# Altium schematic sheet SENSOR.SchDoc
size A3; Organization: Altium Limited; Address1: L3, 12a Rodborough Rd; Address2: Frenchs Forest; Address3: NSW; Address4: Australia 2086; DocumentNumber: 4; SheetNumber: 4; SheetTotal: 5
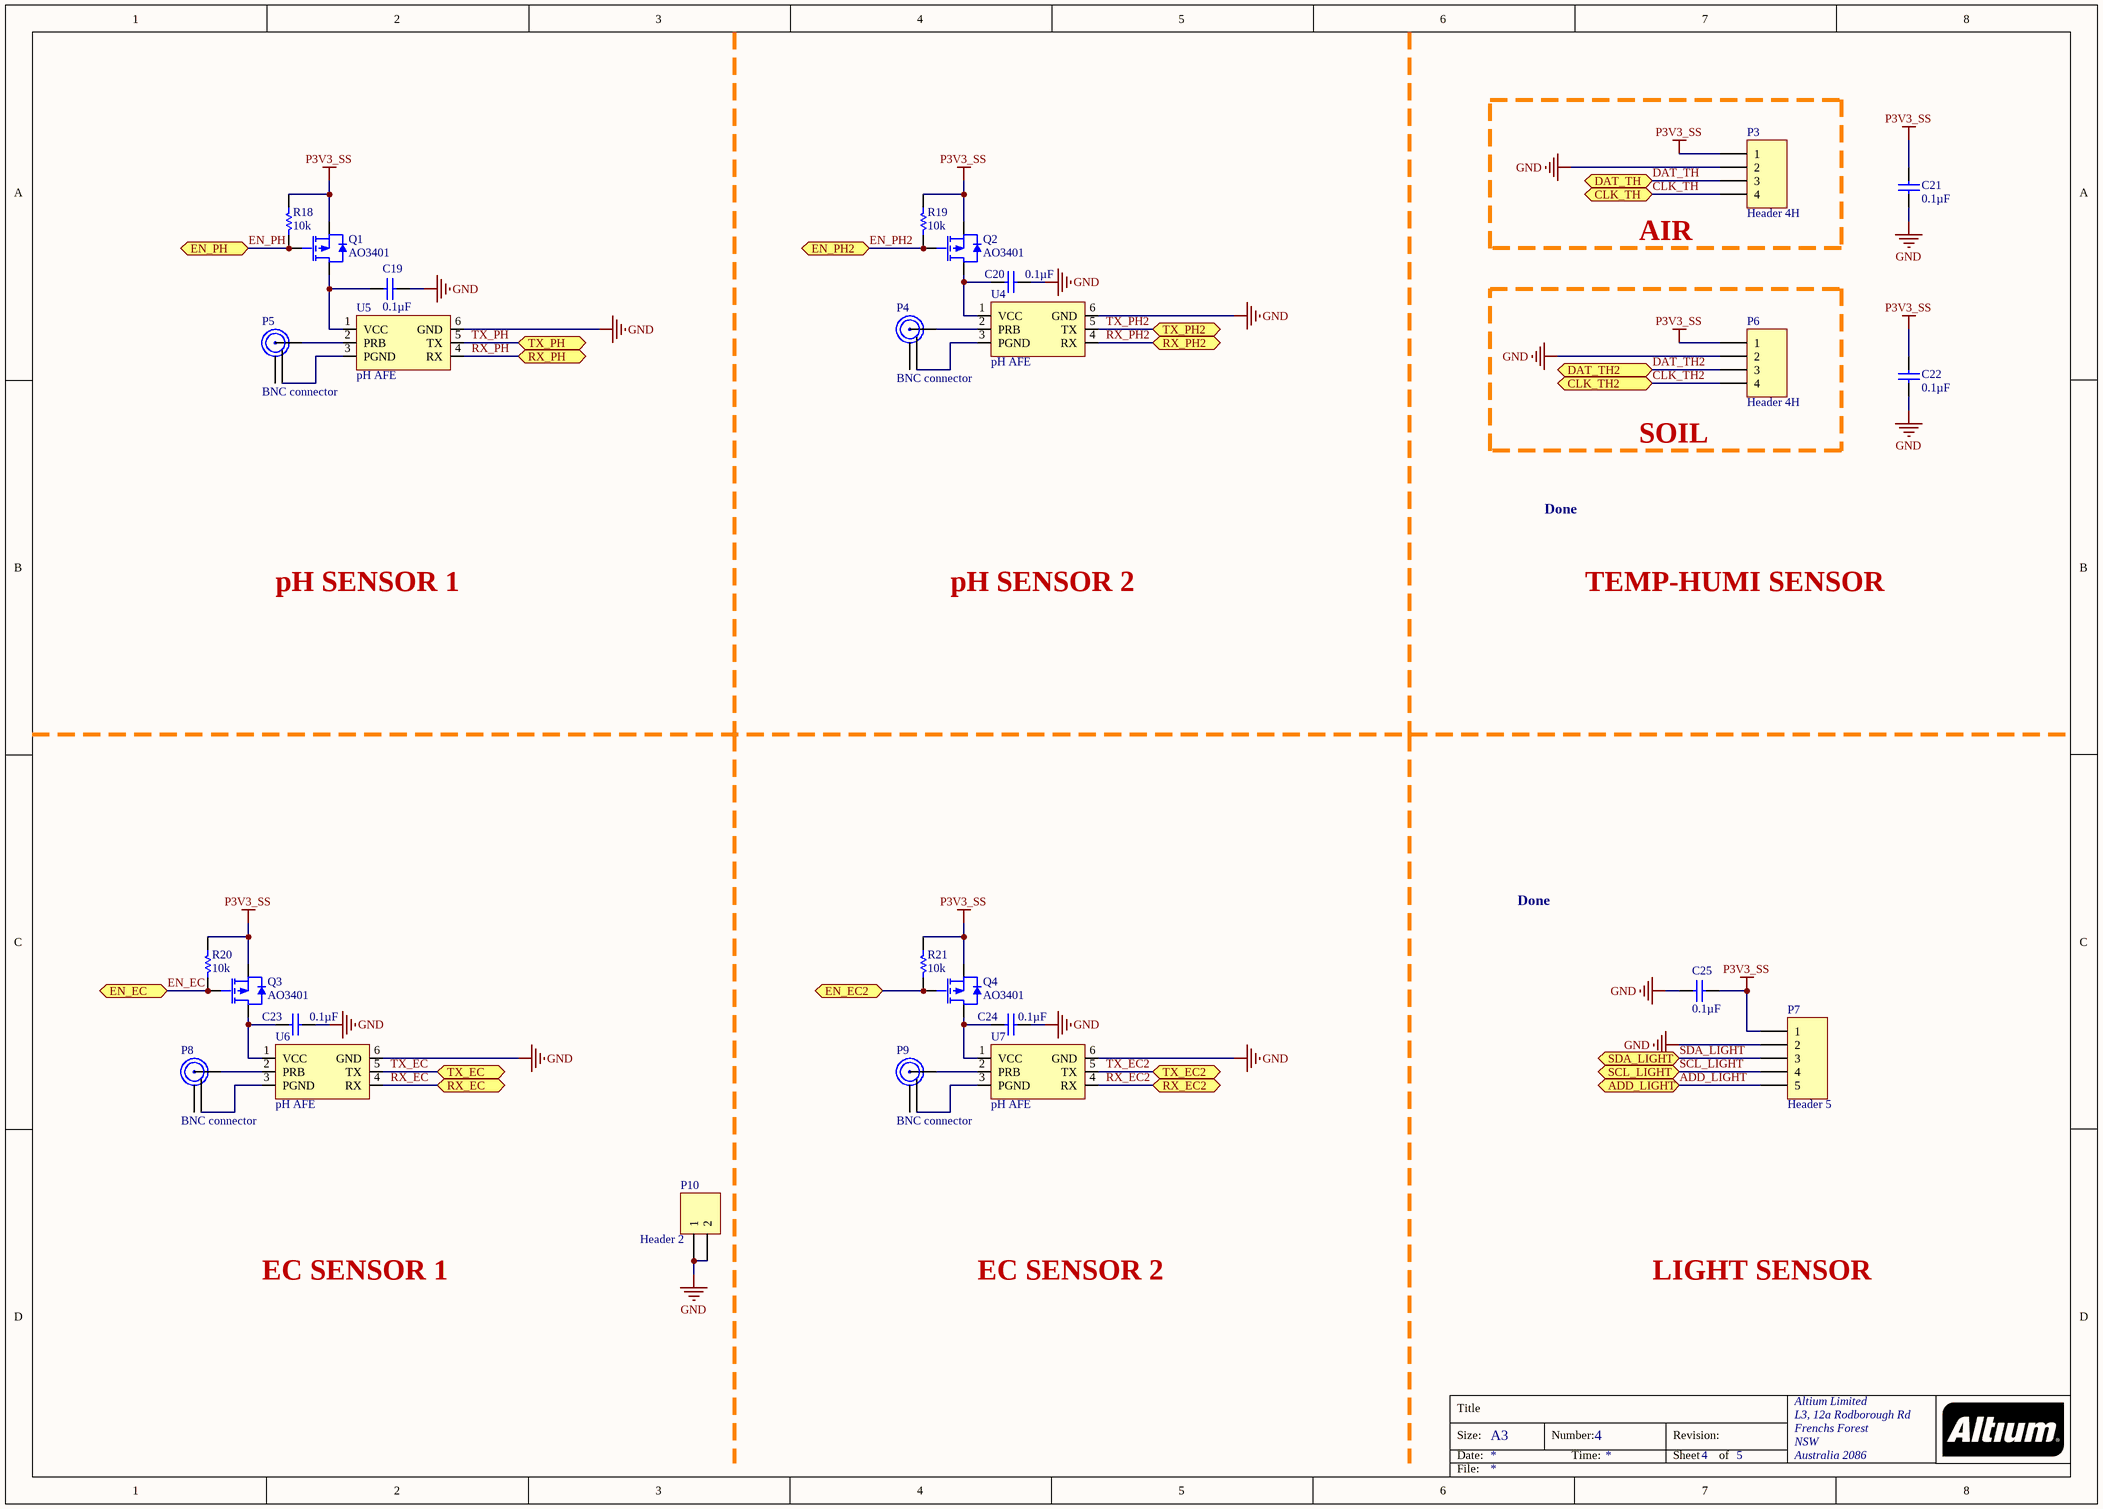
[diagram p0: SENSOR.SchDoc]

## Parts
C19  0.1µF  [C0402M]
C20  0.1µF  [C0402M]
C21  0.1µF  [C0402M]
C22  0.1µF  [C0402M]
C23  0.1µF  [C0402M]
C24  0.1µF  [C0402M]
C25  0.1µF  [C0402M]
P3  Header 4H  [TERMINAL4_5.08]
P4  BNC connector  [BNC]
P5  BNC connector  [BNC]
P6  Header 4H  [TERMINAL4_5.08]
P7  Header 5  [TERMINAL5_5.08]
P8  BNC connector  [BNC]
P9  BNC connector  [BNC]
P10  Header 2  [HED2T]
Q1  AO3401  [SOT23-3N]
Q2  AO3401  [SOT23-3N]
Q3  AO3401  [SOT23-3N]
Q4  AO3401  [SOT23-3N]
R18  10k  [R0603M]
R19  10k  [R0603M]
R20  10k  [R0603M]
R21  10k  [R0603M]
U4  pH AFE  [pH AFE]
U5  pH AFE  [pH AFE]
U6  pH AFE  [pH AFE]
U7  pH AFE  [pH AFE]

## Blocks framed on the sheet
AIR: P3
SOIL: P6

## Ports
ADD_LIGHT, CLK_TH, CLK_TH2, DAT_TH, DAT_TH2, EN_EC, EN_EC2, EN_PH, EN_PH2, RX_EC, RX_EC2, RX_PH, RX_PH2, SCL_LIGHT, SDA_LIGHT, TX_EC, TX_EC2, TX_PH, TX_PH2

## Nets
GND: C19.1 C20.1 C21.1 C22.1 C23.1 C24.1 C25.1 P3.2 P6.2 P7.2 P10.1 P10.2 U4.6(GND) U5.6(GND) U6.6(GND) U7.6(GND)
P3V3_SS: C21.2 C22.2 C25.2 P3.1 P6.1 P7.1 Q1.2(S) Q2.2(S) Q3.2(S) Q4.2(S) R18.2 R19.2 R20.2 R21.2
ADD_LIGHT: P7.5 ; port ADD_LIGHT
CLK_TH: P3.4 ; port CLK_TH
CLK_TH2: P6.4 ; port CLK_TH2
DAT_TH: P3.3 ; port DAT_TH
DAT_TH2: P6.3 ; port DAT_TH2
EN_EC: Q3.1(G) R20.1 ; port EN_EC
EN_EC2: Q4.1(G) R21.1 ; port EN_EC2
EN_PH: Q1.1(G) R18.1 ; port EN_PH
EN_PH2: Q2.1(G) R19.1 ; port EN_PH2
RX_EC: U6.4(RX) ; port RX_EC
RX_EC2: U7.4(RX) ; port RX_EC2
RX_PH: U5.4(RX) ; port RX_PH
RX_PH2: U4.4(RX) ; port RX_PH2
SCL_LIGHT: P7.4 ; port SCL_LIGHT
SDA_LIGHT: P7.3 ; port SDA_LIGHT
TX_EC: U6.5(TX) ; port TX_EC
TX_EC2: U7.5(TX) ; port TX_EC2
TX_PH: U5.5(TX) ; port TX_PH
TX_PH2: U4.5(TX) ; port TX_PH2
NetC19_2: C19.2 Q1.3(D) U5.1(VCC)
NetC20_2: C20.2 Q2.3(D) U4.1(VCC)
NetC23_2: C23.2 Q3.3(D) U6.1(VCC)
NetC24_2: C24.2 Q4.3(D) U7.1(VCC)
NetP4_1: P4.1 U4.2(PRB)
NetP4_2: P4.2 U4.3(PGND)
NetP5_1: P5.1 U5.2(PRB)
NetP5_2: P5.2 U5.3(PGND)
NetP8_1: P8.1 U6.2(PRB)
NetP8_2: P8.2 U6.3(PGND)
NetP9_1: P9.1 U7.2(PRB)
NetP9_2: P9.2 U7.3(PGND)

Not connected (* = marked no-connect by the designer): P4 3; P5 3; P8 3; P9 3

## Notes on the sheet
- Done
- pH SENSOR 1
- pH SENSOR 2
- TEMP-HUMI SENSOR
- EC SENSOR 1
- EC SENSOR 2
- LIGHT SENSOR
- Title
- Size:
- Date:
- A3
- Number:
- Time:
- Revision:
- Sheet
- of
- File:

## Library data of the parts
C19-C25 = CAP0.1u0402: CAP CER 0.1UF 10V X7R 0402; Manufacturer: Taiyo Yuden; Manufacturer Part Number: LMK105B7104KVHF; Tolerance: ±10%; Supplier 1: Digi-Key; RoHS: RoHS Compliant; Category: Capacitors; Stock 1: 23930; Pricing 1: 1=0.1, 10=0.05, 100=0.0223, 500=0.01594, 1000=0.01252, 2500=0.01138, 5000=0.01047 (USD); Packaging: Cut Tape (CT); Part Status: Active; Capacitance: 0.1µF; Voltage - Rated: 10V; Temperature Coefficient: X7R; Operating Temperature: -55°C ~ 125°C; Features: -; Ratings: AEC-Q200; Applications: Automotive; Mounting Type: Surface Mount, MLCC; Package / Case: 0402 (1005 Metric); Size / Dimension: 0.039" L x 0.020" W (1.00mm x 0.50mm); Height - Seated (Max): -; Thickness (Max): 0.022" (0.55mm); Lead Spacing: -; Lead Style: -; ComponentLink1URL: http://www.yuden.co.jp/productdata/catalog/en/mlcc_all_hq_e.pdf; ComponentLink1Description: http://www.yuden.co.jp/productdata/catalog/en/mlcc_all_hq_e.pdf; Supplier Part Number 1: 587-3769-1-ND
P3 P6 = Header 4H: TERM BLOCK PLUG 4POS STR 5.08MM; Manufacturer: Phoenix Contact; Manufacturer Part Number: 1758377; Number of Positions: 4; Number of Levels: 1; Pitch: 0.200" (5.08mm); Plug Wire Entry: 180°; Current - IEC: 12A; Wire Gauge or Range - AWG: 12-30 AWG; Wire Gauge or Range - mm²: 0.2-2.5mm²; Material Flammability Rating: UL94 V-0; Screw Size: M3; Torque - Screw: 0.5-0.6 Nm (4.4-5.3 Lb-In); Wire Strip Length: 7mm; LatestRevisionDate: 17-Jul-2002; LatestRevisionNote: Re-released for DXP Platform.; Publisher: Altium Limited; Supplier 1: Digi-Key; Supplier Part Number 1: 277-1966-ND; RoHS: RoHS Compliant; Category: Connectors, Interconnects; Stock 1: 185; Pricing 1: 1=4.13, 10=3.949, 50=3.8412, 100=3.59, 250=3.30284, 500=3.0515, 1000=2.90793, 2500=2.7284 (USD); Packaging: Bulk; Part Status: Active; Type: Plug, Female Sockets; Positions Per Level: 4; Header Orientation: -; Termination Style: Screw - Clamping Yoke (Tension Sleeve); Mounting Type: Free Hanging (In-Line); Color: Green; Operating Temperature: -; Contact Mating Finish: Tin; Features: Positions Stamped, Retention Latches (Non-Wire Side); Ingress Protection: -; Contact Material: -; Housing Material: Polyamide (PA), Nylon; Contact Tail Length: -; Insulation Height: 0.591" (15.00mm); ComponentLink1URL: https://media.digikey.com/PDF/Data%20Sheets/Phoenix%20Contact%20PDFs/1758377.pdf; ComponentLink1Description: https://media.digikey.com/PDF/Data%20Sheets/Phoenix%20Contact%20PDFs/1758377.pdf
P7 = Header 5: TERM BLOCK PLUG 5POS STR 5.08MM; Manufacturer: Phoenix Contact; Manufacturer Part Number: 1757048; Number of Positions: 5; Number of Levels: 1; Pitch: 0.200" (5.08mm); Plug Wire Entry: 180°; Current - IEC: 12A; Wire Gauge or Range - AWG: 12-30 AWG; Wire Gauge or Range - mm²: 0.2-2.5mm²; Material Flammability Rating: UL94 V-0; Screw Size: M3; Torque - Screw: 0.5-0.6 Nm (4.4-5.3 Lb-In); Wire Strip Length: 7mm; LatestRevisionDate: 17-Jul-2002; LatestRevisionNote: Re-released for DXP Platform.; Publisher: Altium Limited; Supplier 1: Digi-Key; Supplier Part Number 1: 277-1014-ND; RoHS: RoHS Compliant; Category: Connectors, Interconnects; Stock 1: 1718; Pricing 1: 1=4.69, 10=4.488, 50=4.3656, 100=4.08, 250=3.75364, 500=3.46802, 1000=3.30483, 2500=3.1008 (USD); Packaging: Bulk; Part Status: Active; Type: Plug, Female Sockets; Positions Per Level: 5; Header Orientation: -; Termination Style: Screw - Clamping Yoke (Tension Sleeve); Mounting Type: Free Hanging (In-Line); Color: Green; Operating Temperature: -; Contact Mating Finish: Tin; Features: Retention Latches (Non-Wire Side); Ingress Protection: -; Contact Material: -; Housing Material: Polyamide (PA), Nylon; Contact Tail Length: -; Insulation Height: 0.591" (15.00mm); ComponentLink1URL: https://media.digikey.com/pdf/Data%20Sheets/Phoenix%20Contact%20PDFs/1757048.pdf; ComponentLink1Description: https://media.digikey.com/pdf/Data%20Sheets/Phoenix%20Contact%20PDFs/1757048.pdf
P10 = Header 2: Header, 2-Pin; LatestRevisionDate: 17-Jul-2002; LatestRevisionNote: Re-released for DXP Platform.; Publisher: Altium Limited
Q1-Q4 = MOSFET-P1: P-Channel MOSFET
R18-R21 = RES10k0603: RES SMD 10K OHM 1% 1/10W 0603; Manufacturer: Panasonic Electronic Components; Manufacturer Part Number: ERJ-3EKF1002V; Power (Watts): 0.1W, 1/10W; Temperature Coefficient: ±100ppm/°C; Supplier 1: Digi-Key; RoHS: RoHS Compliant; Category: Resistors; Stock 1: 0; Pricing 1: 1=0.1, 10=0.021, 100=0.0087, 1000=0.00389, 2500=0.00338 (USD); Packaging: Digi-Reel®; Part Status: Active; Resistance (Ohms): 10k; Tolerance: ±1%; Composition: Thick Film; Features: Automotive AEC-Q200; Operating Temperature: -55°C ~ 155°C; Package / Case: 0603 (1608 Metric); Supplier Device Package: 0603; Size / Dimension: 0.063" L x 0.031" W (1.60mm x 0.80mm); Height - Seated (Max): 0.022" (0.55mm); Failure Rate: -; ComponentLink1URL: https://industrial.panasonic.com/cdbs/www-data/pdf/RDA0000/AOA0000C298.pdf; ComponentLink1Description: https://industrial.panasonic.com/cdbs/www-data/pdf/RDA0000/AOA0000C298.pdf; Supplier Part Number 1: P10.0KHDKR-ND